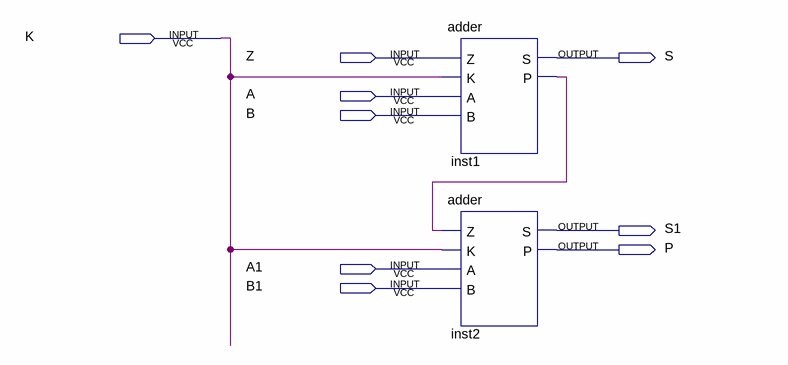
[diagram p0: schematic sheet]
// Quartus schematic labthirdfirst.bdf as structural Verilog: 2 symbols, 9 pins
module labthirdfirst (
  input  K,
  input  Z,
  input  A,
  input  B,
  input  A1,
  input  B1,
  output S,
  output S1,
  output P
);

  wire inst1_p;

  adder inst1 (.Z(Z), .K(K), .A(A), .B(B), .S(S), .P(inst1_p));
  adder inst2 (.Z(inst1_p), .K(K), .A(A1), .B(B1), .S(S1), .P(P));
endmodule
